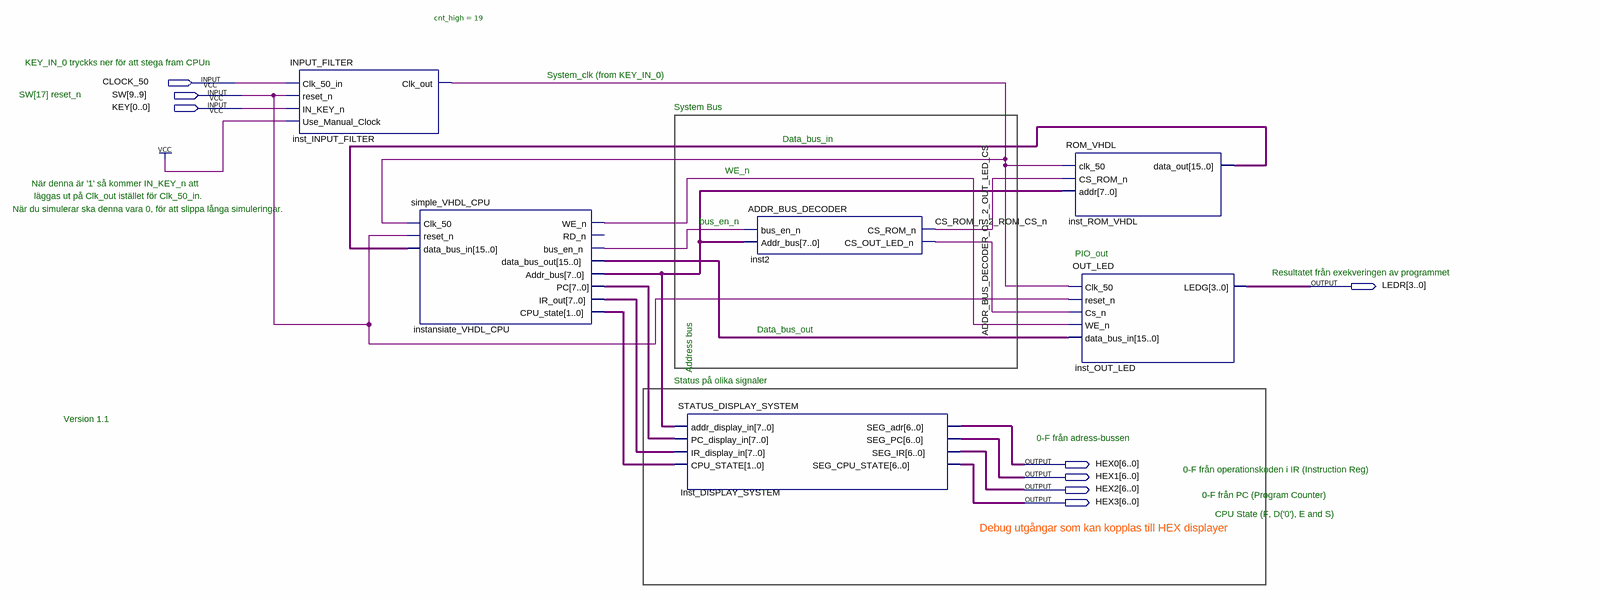
[diagram p0: schematic sheet]
// Quartus schematic CPU_VHDL_projekt.bdf as structural Verilog: 6 symbols, 8 pins
module CPU_VHDL_projekt (
  input  CLOCK_50,
  input  [9:9] SW,
  input  [0:0] KEY,
  output [3:0] LEDR,
  output [6:0] HEX0,
  output [6:0] HEX1,
  output [6:0] HEX2,
  output [6:0] HEX3
);

  wire ADDR_BUS_DECODER_CS_2_OUT_LED_CS, CPU_WE_n_2_OUT_LED_WE_n, CS_ROM_n_2_ROM_CS_n,
       instansiate_VHDL_CPU_bus_en_n, System_clock_signal;
  wire [1:0] CPU_STATE_2_STATUS_DISPALY_SYSTEM;
  wire [7:0] ADRESSBUSS_VALUE_SIGNAL, CPU_IR_2_STATUS_DISPLAY_SYSTEM, CPU_PC_2_STATUS_DISPLAY_SYSTEM;
  wire [15:0] CODE_BUS, DATA_BUS;

  INPUT_FILTER #(.cnt_high(19)) inst_INPUT_FILTER (
    .Clk_50_in(CLOCK_50), .reset_n(SW[9]), .IN_KEY_n(KEY[0]), .Use_Manual_Clock(1'b1),
    .Clk_out(System_clock_signal));
  simple_VHDL_CPU instansiate_VHDL_CPU (
    .Clk_50(System_clock_signal), .reset_n(SW[9]), .data_bus_in(CODE_BUS), .WE_n(CPU_WE_n_2_OUT_LED_WE_n),
    .bus_en_n(instansiate_VHDL_CPU_bus_en_n), .data_bus_out(DATA_BUS), .Addr_bus(ADRESSBUSS_VALUE_SIGNAL),
    .IR_out(CPU_IR_2_STATUS_DISPLAY_SYSTEM), .CPU_state(CPU_STATE_2_STATUS_DISPALY_SYSTEM),
    .PC(CPU_PC_2_STATUS_DISPLAY_SYSTEM));  // open: RD_n
  STATUS_DISPLAY_SYSTEM Inst_DISPLAY_SYSTEM (
    .addr_display_in(ADRESSBUSS_VALUE_SIGNAL), .PC_display_in(CPU_PC_2_STATUS_DISPLAY_SYSTEM),
    .IR_display_in(CPU_IR_2_STATUS_DISPLAY_SYSTEM), .CPU_STATE(CPU_STATE_2_STATUS_DISPALY_SYSTEM),
    .SEG_adr(HEX0), .SEG_PC(HEX1), .SEG_IR(HEX2), .SEG_CPU_STATE(HEX3));
  ADDR_BUS_DECODER inst2 (
    .bus_en_n(instansiate_VHDL_CPU_bus_en_n), .Addr_bus(ADRESSBUSS_VALUE_SIGNAL),
    .CS_ROM_n(CS_ROM_n_2_ROM_CS_n), .CS_OUT_LED_n(ADDR_BUS_DECODER_CS_2_OUT_LED_CS));
  ROM_VHDL inst_ROM_VHDL (
    .clk_50(System_clock_signal), .CS_ROM_n(CS_ROM_n_2_ROM_CS_n), .addr(ADRESSBUSS_VALUE_SIGNAL),
    .data_out(CODE_BUS));
  OUT_LED inst_OUT_LED (
    .Clk_50(System_clock_signal), .reset_n(SW[9]), .Cs_n(ADDR_BUS_DECODER_CS_2_OUT_LED_CS),
    .WE_n(CPU_WE_n_2_OUT_LED_WE_n), .data_bus_in(DATA_BUS), .LEDG(LEDR));

  // Other names for the same wires on the sheet: CLOCK_50_SIGNAL_WIRE = CLOCK_50;
  //   CPU_STATES_AS_SEVEN_SEG_2_OUTPUTS[6:0] = HEX3; ADRESS_AS_SEVEN_SEG_2_OUPUT[6:0] = HEX0;
  //   IR_AS_SEVENSEG_2_OUTPUT[6:0] = HEX2; LED_SIGNALS_TO_OUTPUT[3:0] = LEDR; Manual_key_input_signal_wire = KEY[0];
  //   PC_AS_SEVEN_SEG_2_OUTPUT[6:0] = HEX1; reset_n_signal_wire = SW[9]

  // Notes on the sheet:
  //   KEY_IN_0 tryckks ner för att stega fram CPUn
  //   System_clk (from KEY_IN_0)
  //   SW[17] reset_n
  //   System Bus
  //   Data_bus_in
  //   WE_n
  //   När denna är '1' så kommer IN_KEY_n att
  //    läggas ut på Clk_out istället för Clk_50_in.
  //   När du simulerar ska denna vara 0, för att slippa långa simuleringar.
  //   bus_en_n
  //   PIO_out
  //   Resultatet från exekveringen av programmet
  //   Address bus
  //   Data_bus_out
  //   Status på olika signaler
  //   Version 1.1
  //   0-F från adress-bussen
  //   0-F från operationskoden i IR (Instruction Reg)
  //   0-F från PC (Program Counter)
  //   CPU State (F, D('0'), E and S)
  //   Debug utgångar som kan kopplas till HEX displayer
endmodule
